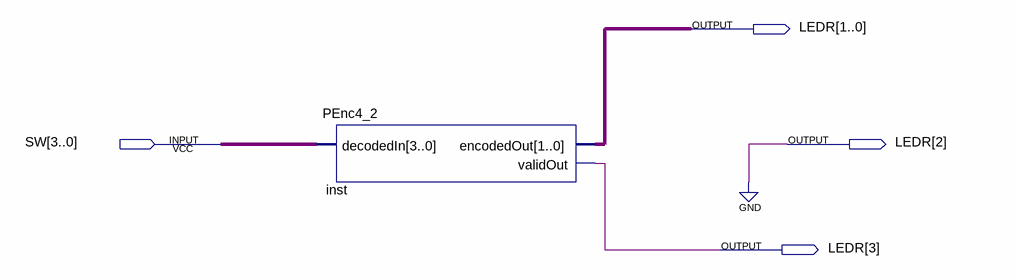
[diagram p0: schematic sheet]
// Quartus schematic PEnc4_2Demo.bdf as structural Verilog: 1 symbols, 4 pins
module PEnc4_2Demo (
  input  [3:0] SW,
  output [3:0] LEDR
);

  PEnc4_2 inst (.decodedIn(SW), .encodedOut(LEDR[1:0]), .validOut(LEDR[3]));

  assign LEDR[2] = 1'b0;
endmodule
